# EAGLE design PiHat-Extended (EAGLE 9.4.2)

## Sheet 1 of 4
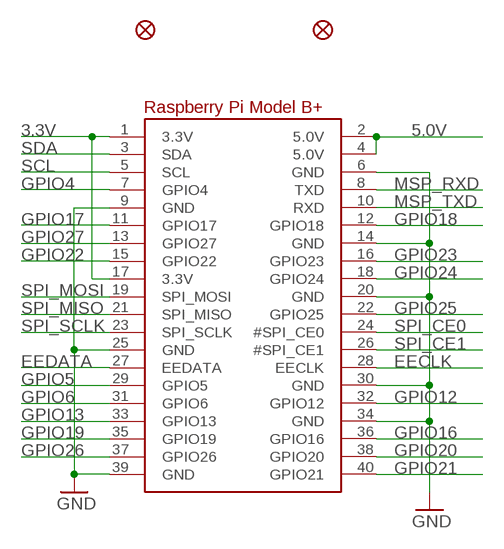
[diagram p0: schematic, sheet 1]

### Parts
FID2  MICROBUILDER_FIDUCIAL""  [MICROBUILDER_FIDUCIAL_1MM]
FID3  MICROBUILDER_FIDUCIAL""  [MICROBUILDER_FIDUCIAL_1MM]
RPI1  MICROBUILDER_RASPBERRYPI_BPLUS_HATNOSLOTS  [MICROBUILDER_PI_HAT_NOSLOTS]

### Nets
3.3V: RPI1.1(3.3V) RPI1.17(3.3V)
5.0V: RPI1.2(5.0V) RPI1.4(5.0V) ; also sheet 2,3
EECLK: RPI1.28(EECLK)
EEDATA: RPI1.27(EEDATA)
GND: RPI1.6(GND) RPI1.9(GND) RPI1.14(GND) RPI1.20(GND) RPI1.25(GND) RPI1.30(GND) RPI1.34(GND) RPI1.39(GND) ; also sheet 2,3,4
GPIO4: RPI1.7(GPIO4)
GPIO5: RPI1.29(GPIO5) ; also sheet 2
GPIO6: RPI1.31(GPIO6) ; also sheet 2
GPIO12: RPI1.32(GPIO12)
GPIO13: RPI1.33(GPIO13)
GPIO16: RPI1.36(GPIO16) ; also sheet 2,4
GPIO17: RPI1.11(GPIO17) ; also sheet 2,4
GPIO18: RPI1.12(GPIO18)
GPIO19: RPI1.35(GPIO19)
GPIO20: RPI1.38(GPIO20)
GPIO21: RPI1.40(GPIO21)
GPIO22: RPI1.15(GPIO22) ; also sheet 2,4
GPIO23: RPI1.16(GPIO23) ; also sheet 2,4
GPIO24: RPI1.18(GPIO24) ; also sheet 2,4
GPIO25: RPI1.22(GPIO25) ; also sheet 2,4
GPIO26: RPI1.37(GPIO26) ; also sheet 2,4
GPIO27: RPI1.13(GPIO27) ; also sheet 2,4
MSP_RXD: RPI1.8(TXD) ; also sheet 2,3
MSP_TXD: RPI1.10(RXD) ; also sheet 2,3
SCL: RPI1.5(SCL)
SDA: RPI1.3(SDA)
SPI_CE0: RPI1.24(#SPI_CE0)
SPI_CE1: RPI1.26(#SPI_CE1)
SPI_MISO: RPI1.21(SPI_MISO)
SPI_MOSI: RPI1.19(SPI_MOSI)
SPI_SCLK: RPI1.23(SPI_SCLK)

## Sheet 2 of 4
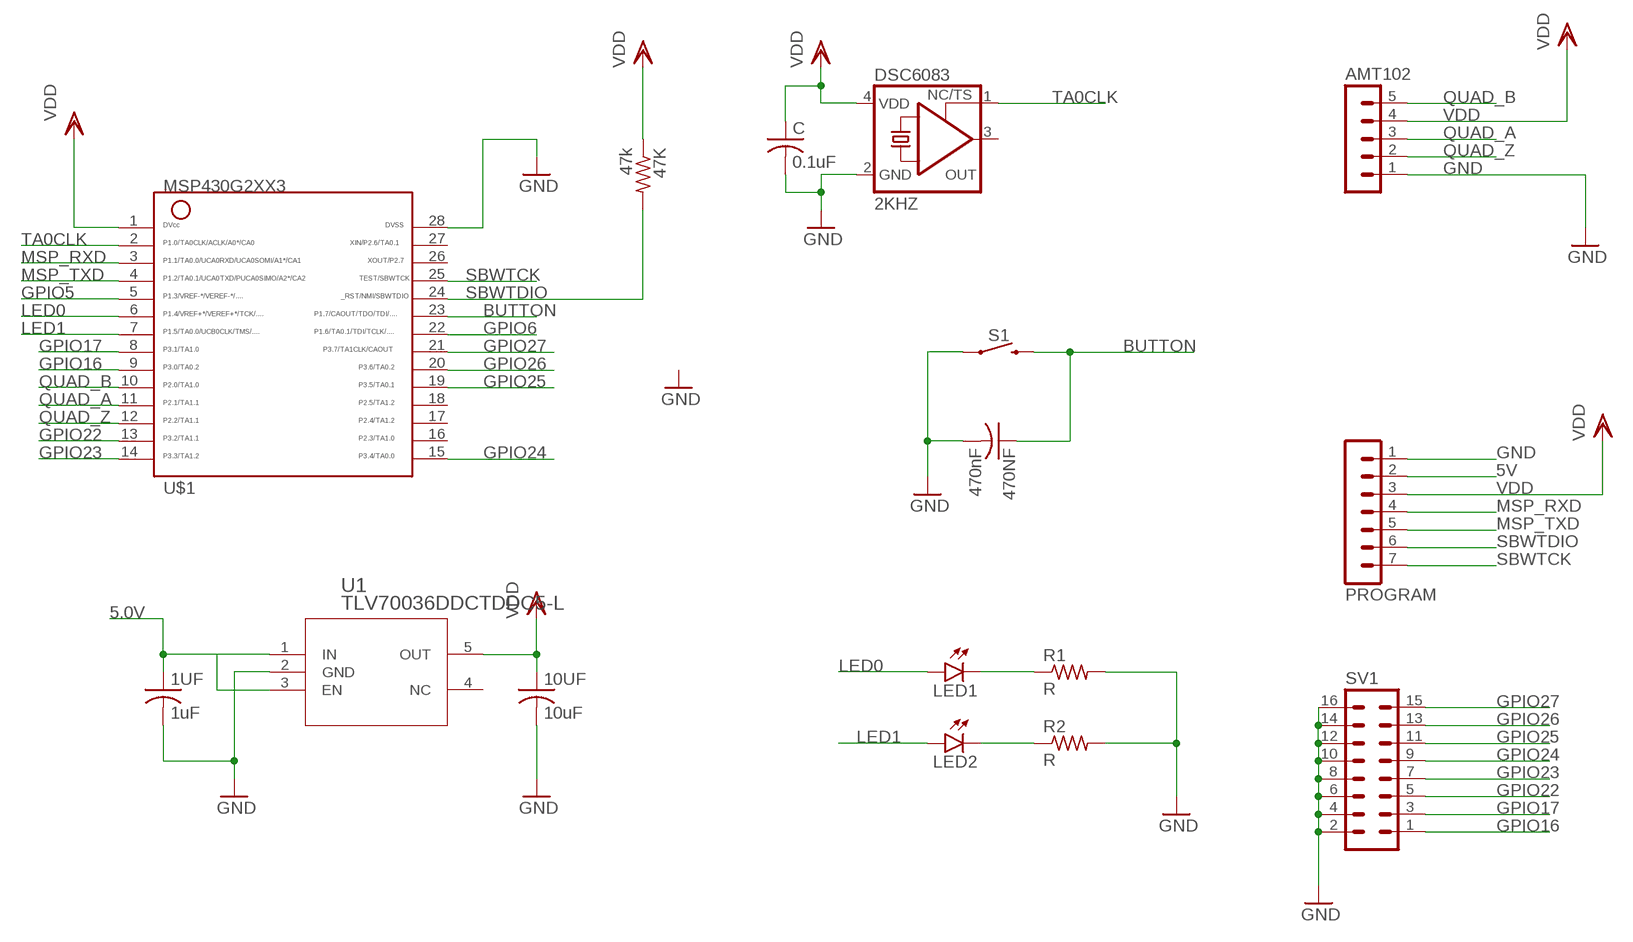
[diagram p1: schematic, sheet 2]

### Parts
1UF  1uF  C-USC0603  [C0603]
10UF  10uF  C-USC1206  [C1206]
47K  47k  R-US_R0603  [R0603]
470NF  470nF  C-USC0603  [C0603]
AMT102  MA05-1  [MA05-1]
C  0.1uF  C-USC0603  [C0603]
DSC6083  2KHZ  KXO-PXO/XO-V96  [3.2X2.5_KXO-V96]
LED1  LEDCHIPLED_1206  [CHIPLED_1206]
LED2  LEDCHIPLED_1206  [CHIPLED_1206]
PROGRAM  MA07-1  [MA07-1]
R1  R  R-US_R0603  [R0603]
R2  R  R-US_R0603  [R0603]
S1  MOMENTARY-SWITCH-SPST-PTH-6.0MM  [TACTILE_SWITCH_PTH_6.0MM]
SV1  MA08-2  [MA08-2]
U1  TLV70036DDCTDDC5-L  [DDC5-L]
U$1  MSP430  G2XX3---PW28  [PW28]

### Nets
5.0V: 1UF.1 U1.1(IN) U1.3(EN) ; also sheet 1,3
5V: PROGRAM.2
BUTTON: 470NF.1 S1.3 U$1.23
GND: 1UF.2 10UF.2 470NF.2 AMT102.1 C.2 DSC6083.2(GND) PROGRAM.1 R1.2 R2.2 S1.1 SV1.2 SV1.4 SV1.6 SV1.8 SV1.10 SV1.12 SV1.14 SV1.16 U1.2(GND) U$1.28 ; also sheet 1,3,4
GPIO5: U$1.5 ; also sheet 1
GPIO6: U$1.22 ; also sheet 1
GPIO16: SV1.1 U$1.9 ; also sheet 1,4
GPIO17: SV1.3 U$1.8 ; also sheet 1,4
GPIO22: SV1.5 U$1.13 ; also sheet 1,4
GPIO23: SV1.7 U$1.14 ; also sheet 1,4
GPIO24: SV1.9 U$1.15 ; also sheet 1,4
GPIO25: SV1.11 U$1.19 ; also sheet 1,4
GPIO26: SV1.13 U$1.20 ; also sheet 1,4
GPIO27: SV1.15 U$1.21 ; also sheet 1,4
LED0: LED1.A U$1.6
LED1: LED2.A U$1.7
MSP_RXD: PROGRAM.4 U$1.3 ; also sheet 1,3
MSP_TXD: PROGRAM.5 U$1.4 ; also sheet 1,3
N$1: LED1.C R1.1
N$2: LED2.C R2.1
QUAD_A: AMT102.3 U$1.11
QUAD_B: AMT102.5 U$1.10
QUAD_Z: AMT102.2 U$1.12
SBWTCK: PROGRAM.7 U$1.25
SBWTDIO: 47K.2 PROGRAM.6 U$1.24
TA0CLK: DSC6083.1(TS) U$1.2
VDD: 10UF.1 47K.1 AMT102.4 C.1 DSC6083.4(VDD) PROGRAM.3 U1.5(OUT) U$1.1 ; also sheet 4
Unconnected: DSC6083.3(OUT) U1.4(NC) U$1.16 U$1.17 U$1.18 U$1.26 U$1.27

## Sheet 3 of 4
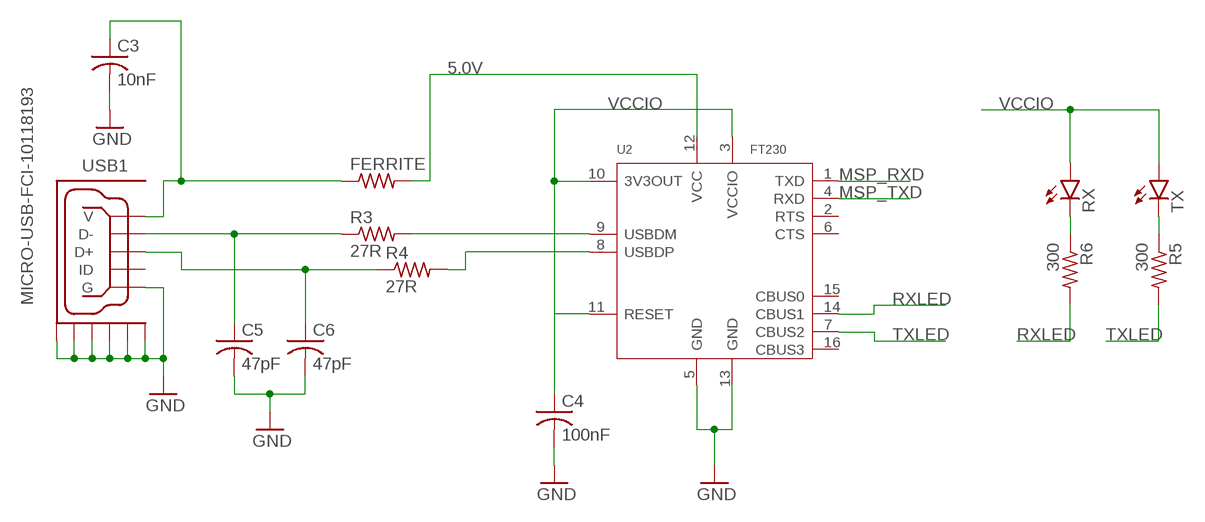
[diagram p2: schematic, sheet 3]

### Parts
C3  10nF  C-USC0603  [C0603]
C4  100nF  C-USC0603  [C0603]
C5  47pF  C-USC0603  [C0603]
C6  47pF  C-USC0603  [C0603]
FERRITE  R-US_R0805  [R0805]
R3  27R  R-US_R0603  [R0603]
R4  27R  R-US_R0603  [R0603]
R5  300  R-US_R0603  [R0603]
R6  300  R-US_R0603  [R0603]
RX  LEDCHIPLED_1206  [CHIPLED_1206]
TX  LEDCHIPLED_1206  [CHIPLED_1206]
U2  FT230  INTERFACE-FT230XS-R(SSOP16)  [SSOP16-0.635-5X4MM]
USB1  MICRO-USB-FCI-10118193  [FCI-10118193-0001LF]

### Nets
5.0V: FERRITE.2 U2.12(VCC) ; also sheet 1,2
GND: C3.2 C4.2 C5.2 C6.2 U2.5(GND) U2.13(GND) USB1.5(G) USB1.G1(GND1) USB1.G2(GND2) USB1.G3(GND3) USB1.G4(GND4) USB1.G5(GND5) USB1.G6(GND6) ; also sheet 1,2,4
MSP_RXD: U2.1(TXD) ; also sheet 1,2
MSP_TXD: U2.4(RXD) ; also sheet 1,2
N$3: C3.1 FERRITE.1 USB1.1(V)
N$4: C5.1 R3.1 USB1.2(D-)
N$5: R3.2 U2.9(USBDM)
N$7: C6.1 R4.1 USB1.3(D+)
N$8: R4.2 U2.8(USBDP)
N$9: R6.1 RX.C
N$10: R5.1 TX.C
RXLED: R6.2 U2.14(CBUS1)
TXLED: R5.2 U2.7(CBUS2)
VCCIO: C4.1 RX.A TX.A U2.3(VCCIO) U2.10(3V3OUT) U2.11(RESET)
Unconnected: U2.2(RTS) U2.6(CTS) U2.15(CBUS0) U2.16(CBUS3) USB1.4(ID)

## Sheet 4 of 4
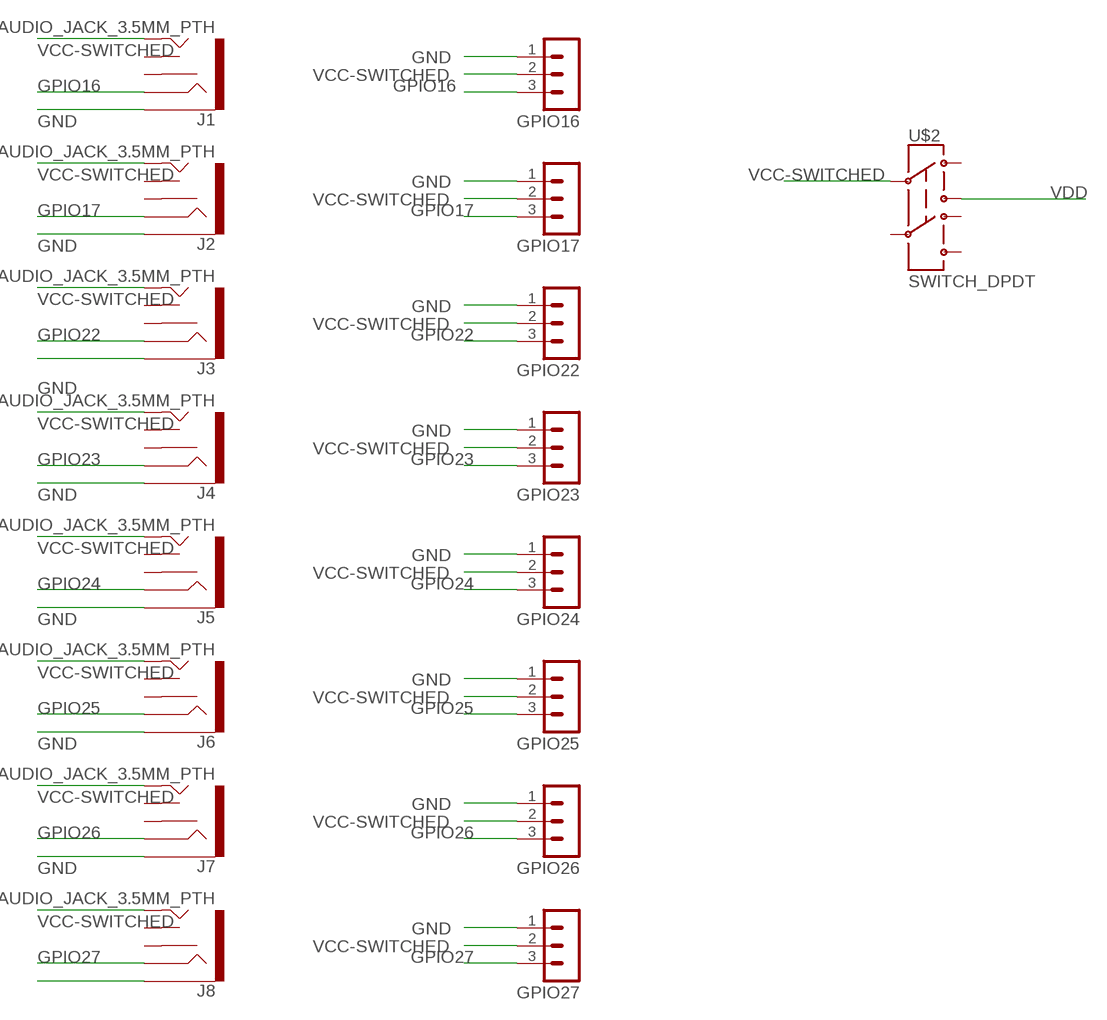
[diagram p3: schematic, sheet 4]

### Parts
GPIO16  MA03-1  [MA03-1]
GPIO17  MA03-1  [MA03-1]
GPIO22  MA03-1  [MA03-1]
GPIO23  MA03-1  [MA03-1]
GPIO24  MA03-1  [MA03-1]
GPIO25  MA03-1  [MA03-1]
GPIO26  MA03-1  [MA03-1]
GPIO27  MA03-1  [MA03-1]
J1  AUDIO_JACK_3.5MM_PTH  [AUDIO-JACK]
J2  AUDIO_JACK_3.5MM_PTH  [AUDIO-JACK]
J3  AUDIO_JACK_3.5MM_PTH  [AUDIO-JACK]
J4  AUDIO_JACK_3.5MM_PTH  [AUDIO-JACK]
J5  AUDIO_JACK_3.5MM_PTH  [AUDIO-JACK]
J6  AUDIO_JACK_3.5MM_PTH  [AUDIO-JACK]
J7  AUDIO_JACK_3.5MM_PTH  [AUDIO-JACK]
J8  AUDIO_JACK_3.5MM_PTH  [AUDIO-JACK]
U$2  SWITCH_DPDT  [JS_DPDT_TH]

### Nets
GND: GPIO16.1 GPIO17.1 GPIO22.1 GPIO23.1 GPIO24.1 GPIO25.1 GPIO26.1 GPIO27.1 J1.SLEEVE J2.SLEEVE J3.SLEEVE J4.SLEEVE J5.SLEEVE J6.SLEEVE J7.SLEEVE J8.SLEEVE ; also sheet 1,2,3
GPIO16: GPIO16.3 J1.RING ; also sheet 1,2
GPIO17: GPIO17.3 J2.RING ; also sheet 1,2
GPIO22: GPIO22.3 J3.RING ; also sheet 1,2
GPIO23: GPIO23.3 J4.RING ; also sheet 1,2
GPIO24: GPIO24.3 J5.RING ; also sheet 1,2
GPIO25: GPIO25.3 J6.RING ; also sheet 1,2
GPIO26: GPIO26.3 J7.RING ; also sheet 1,2
GPIO27: GPIO27.3 J8.RING ; also sheet 1,2
VCC-SWITCHED: GPIO16.2 GPIO17.2 GPIO22.2 GPIO23.2 GPIO24.2 GPIO25.2 GPIO26.2 GPIO27.2 J1.TIP J2.TIP J3.TIP J4.TIP J5.TIP J6.TIP J7.TIP J8.TIP U$2.2
VDD: U$2.3 ; also sheet 2
Unconnected: J1.RSH J1.TSH J2.RSH J2.TSH J3.RSH J3.TSH J4.RSH J4.TSH J5.RSH J5.TSH J6.RSH J6.TSH J7.RSH J7.TSH J8.RSH J8.TSH U$2.1 U$2.4 U$2.5 U$2.6

## Library data of the parts
1UF 10UF 470NF C = rcl:C-US: CAPACITOR, American symbol; SPICEPREFIX: C
47K FERRITE R1 R2 = rcl:R-US_: RESISTOR, American symbol; SPICEPREFIX: R
AMT102 = con-lstb-mod:MA05-1: PIN HEADER; OC_FARNELL: unknown; OC_NEWARK: unknown
C3-C6 = resistor:C-US: CAPACITOR, American symbol
DSC6083 = crystal-geyer_V1_0:KXO-PXO/XO-V: Clock Oscillator (PXO/XO) MHz : KXO-V - Serie Model Size l/w/h [mm] Frequency Range Frequency Stability Temp. Range [°C] Output AECQ 200 availabel Datasheet KXO-V94 KXO-V94 KXO-V95 KXO-V95 KXO-V96 KXO-V96 KXO-V99 KXO-V99 KXO-97 KXO-V97 KXO-97 - KXO-V97 2.0/1.6/0.80 2.0/1.6/0.80 2.5/2.0/0.82 2.5/2.0/0.82 3.2/2.5/1.2 3.2/2.5/1.2 5.0/3.2/1.2 5.0/3.2/1.2 7.0/5.08/1.3 7.0/5.08/1.3 7.0/5.08/1.3 32,768 kHz 1,0 ~ 80,0 MHz 32,768 kHz 1,0 ~ 70,0 MHz 32,768 kHz 1,0 ~ 156,0 MHz 32,768 kHz 1,0 ~ 200,0 MHz 32,768 kHz 32,768 kHz 1,0 ~ 160,0 MHz ±25 … ±100ppm ±25 … ±100ppm ±25 … ±100ppm ±25 … ±100ppm ±25 … ±100ppm ±25 … ±100ppm ±25 … ±100ppm ±25 … ±100ppm ±25 … ±100ppm ±25 … ±100ppm ±25 … ±100ppm (*) -40°C …+85°C (*) -40°C …+85°C (*) -40°C …+85°C (*) -40°C …+85°C (*) -40°C …+85°C (*) -40°C …+85°C (*) -40°C …+85°C (*) -40°C …+85°C (*) -40°C …+85°C (*) -40°C …+85°C (*) -40°C …+85°C HCMOS HCMOS HCMOS HCMOS HCMOS HCMOS HCMOS HCMOS HCMOS HCMOS HCMOS - - yes yes yes yes - - - - - KXO-V94-kHz.pdf <http://www.geyer-electronic.de/uploads/tx_userartikelfrequenz/GEYER-KXO-V94-kHz.pdf> KXO-V94.pdf <http://www.geyer-electronic.de/uploads/tx_userartikelfrequenz/GEYER-KXO-V94.pdf> KXO-V95-kHz.pdf <http://www.geyer-electronic.de/uploads/tx_userartikelfrequenz/GEYER-KXO-V95-kHz.pdf> KXO-V95.pdf <http://www.geyer-electronic.de/uploads/tx_userartikelfrequenz/GEYER-KXO-V95.pdf> KXO-V96-kHz.pdf <http://www.geyer-electronic.de/uploads/tx_userartikelfrequenz/GEYER-KXO-V96-kHz.pdf> KXO-V96.pdf <http://www.geyer-electronic.de/uploads/tx_userartikelfrequenz/GEYER-KXO-V96.pdf> KXO-V99-kHz.pdf <http://www.geyer-electronic.de/uploads/tx_userartikelfrequenz/GEYER-KXO-V99-kHz.pdf> KXO-V99.pdf <http://www.geyer-electronic.de/uploads/tx_userartikelfrequenz/GEYER-KXO-V99.pdf> KXO-97-kHz.pdf <http://www.geyer-electronic.de/uploads/tx_userartikelfrequenz/GEYER-KXO-97-kHz.pdf> KXO-V97-kHz.pdf <http://www.geyer-electronic.de/uploads/tx_userartikelfrequenz/GEYER-KXO-V97-kHz.pdf> KXO-V97.pdf <http://www.geyer-electronic.de/uploads/tx_userartikelfrequenz/GEYER-KXO-V97.pdf> <http://www.geyer-electronic.de/fileadmin/template/img/logo-geyer-electronic.png> Details see: http://www.geyer-electronic.de/Frequenz-Produkte.9.0.html Created 2016-06-07, Hans Locher 2016 (C) Geyer Quartz Technology Hans Locher KXOV94,KXOV95;KXOV96;KXOV97;KXO97;2016;2520;3225;5032;70508;2,5x2,0;3,2x2,5;5,0x3,2;7,0x5,08;2.5x2.0;3.2x2.5;5.0x3.2;7.0x5.08;
FID2 FID3 = PiHat-Extended:MICROBUILDER_FIDUCIAL: Fiducial Alignment Points Various fiducial points for machine vision alignment.; BOM: EXCLUDE
GPIO16 GPIO17 GPIO22-GPIO27 = con-lstb:MA03-1: PIN HEADER; OC_FARNELL: unknown; OC_NEWARK: unknown
J1-J8 = SparkFun-Connectors:AUDIO_JACK_3.5MM: Audio Jack 3.5mm variants of PTH and SMT stereo audio jack with bypass switches. SparkFun Products: SparkFun SparkPunk Sound Kit <[https://www.sparkfun.com/products/11177]> - PTH MP3 Trigger <https://www.sparkfun.com/products/13720> -3.5mm SMD SparkFun PicoBoard <https://www.sparkfun.com/products/11888>- 2.5mm SMD; PROD_ID: CONN-08774; SF_ID: PRT-08032
LED1 LED2 RX TX = led:LED: LED OSRAM: - CHIPLED LG R971, LG N971, LY N971, LG Q971, LY Q971, LO R971, LY R971 LH N974, LH R974 LS Q976, LO Q976, LY Q976 LO Q996 - Hyper CHIPLED LW Q18S LB Q993, LB Q99A, LB R99A - SideLED LS A670, LO A670, LY A670, LG A670, LP A670 LB A673, LV A673, LT A673, LW A673 LH A674 LY A675 LS A676, LA A676, LO A676, LY A676, LW A676 LS A679, LY A679, LG A679 - Hyper Micro SIDELED® LS Y876, LA Y876, LO Y876, LY Y876 LT Y87S - SmartLED LW L88C, LW L88S LB L89C, LB L89S, LG L890 LS L89K, LO L89K, LY L89K LS L896, LA L896, LO L896, LY L896 - TOPLED LS T670, LO T670, LY T670, LG T670, LP T670 LSG T670, LSP T670, LSY T670, LOP T670, LYG T670 LG T671, LOG T671, LSG T671 LB T673, LV T673, LT T673, LW T673 LH T674 LS T676, LA T676, LO T676, LY T676, LB T676, LH T676, LSB T676, LW T676 LB T67C, LV T67C, LT T67C, LS T67K, LO T67K, LY T67K, LW E67C LS E67B, LA E67B, LO E67B, LY E67B, LB E67C, LV E67C, LT E67C LW T67C LS T679, LY T679, LG T679 LS T770, LO T770, LY T770, LG T770, LP T770 LB T773, LV T773, LT T773, LW T773 LH T774 LS E675, LA E675, LY E675, LS T675 LS T776, LA T776, LO T776, LY T776, LB T776 LHGB T686 LT T68C, LB T68C - Hyper Mini TOPLED® LB M676 - Mini TOPLED Santana® LG M470 LS M47K, LO M47K, LY M47K Source: http://www.osram.convergy.de LUXEON: - LUMILED® LXK2-PW12-R00, LXK2-PW12-S00, LXK2-PW14-U00, LXK2-PW14-V00 LXK2-PM12-R00, LXK2-PM12-S00, LXK2-PM14-U00 LXK2-PE12-Q00, LXK2-PE12-R00, LXK2-PE12-S00, LXK2-PE14-T00, LXK2-PE14-U00 LXK2-PB12-K00, LXK2-PB12-L00, LXK2-PB12-M00, LXK2-PB14-N00, LXK2-PB14-P00, LXK2-PB14-Q00 LXK2-PR12-L00, LXK2-PR12-M00, LXK2-PR14-Q00, LXK2-PR14-R00 LXK2-PD12-Q00, LXK2-PD12-R00, LXK2-PD12-S00 LXK2-PH12-R00, LXK2-PH12-S00 LXK2-PL12-P00, LXK2-PL12-Q00, LXK2-PL12-R00 Source: www.luxeon.com KINGBRIGHT: KA-3528ASYC Source: www.kingbright.com
PROGRAM = con-lstb-mod:MA07-1: PIN HEADER; OC_FARNELL: unknown; OC_NEWARK: unknown
R3-R6 = resistor:R-US_: RESISTOR, American symbol
RPI1 = PiHat-Extended:MICROBUILDER_RASPBERRYPI_BPLUS
S1 = SparkFun-Switches:MOMENTARY-SWITCH-SPST: Momentary Switch (Pushbutton) - SPST Normally-open (NO) SPST momentary switches (buttons, pushbuttons). Variants PTH-12MM - 12mm square, through-hole Momentary Pushbutton Switch - 12mm Square <https://www.sparkfun.com/products/9190> (COM-09190) PTH-6.0MM, PTH-6.0MM-KIT - 6.0mm square, through-hole Mini Pushbutton Switch <https://www.sparkfun.com/products/97> (COM-00097) KIT package intended for soldering kit's - only one side of pads' copper is exposed. PTH-RIGHT-ANGLE-KIT - Right-angle, through-hole Right Angle Tactile Button <https://www.sparkfun.com/products/10791> - Used on SparkFun BigTime Watch Kit <https://www.sparkfun.com/products/11734> SMD-12MM - 12mm square, surface-mount Tactile Button - SMD (12mm) <https://www.sparkfun.com/products/12993> (COM-12993) Used on SparkFun PicoBoard <https://www.sparkfun.com/products/11888> SMD-4.5MM - 4.5mm Square Trackball Switch Used on SparkFun Blackberry Trackballer Breakout <https://www.sparkfun.com/products/13169> SMD-4.6MMX2.8MM - 4.60mm x 2.80mm, surface mount Used on SparkFun SAMD21 Mini Breakout <https://www.sparkfun.com/products/13664> SMD-5.2MM, SMD-5.2-REDUNDANT - 5.2mm square, surface-mount Mini Pushbutton Switch - SMD <https://www.sparkfun.com/products/8720> (COM-08720) Used on Arduino Pro Mini <https://www.sparkfun.com/products/11114> REDUNDANT package connects both switch circuits together SMD-6.0X3.5MM - 6.0 x 3.5mm, surface mount Momentary Reset Switch SMD <https://www.sparkfun.com/products/8229> (COM-08229) SMD-6.2MM-TALL - 6.2mm square, surface mount Tactile Button - SMD (6mm) <https://www.sparkfun.com/products/12992> Used on SparkFun Digital Sandbox <https://www.sparkfun.com/products/12651> SMD-RIGHT-ANGLE - Right-angle, surface mount Used on SparkFun Block for Intel® Edison - Arduino <https://www.sparkfun.com/products/13036>; PROD_ID: SWCH-08441; SF_SKU: COM-00097
SV1 = con-lstb-mod:MA08-2: PIN HEADER; OC_FARNELL: unknown; OC_NEWARK: unknown
U1 = TLV70036:TLV70036DDCT; MANUFACTURER_PART_NUMBER: TLV70036DDCT; VENDOR: Texas Instruments
U2 = OPL_IC:INTERFACE-FT230XS-R(SSOP16): 310070030; MPN: FT230XS-R; VALUE: FT230XS-R-SSOP16
U$1 = TI_MSP430_v16:G2XX3---PW28: MSP430G2XX1 TSSOP (PW) 28 Pin Package
U$2 = ELEC327:SWITCH_DPDT
USB1 = microftx:MICRO-USB: MICRO USB B, BOTTOM MOUNT From the MicroFTX by Jim Paris (http://jim.sh/ftx)

## Net classes
0 default: clearance 0.205 mm

## Board
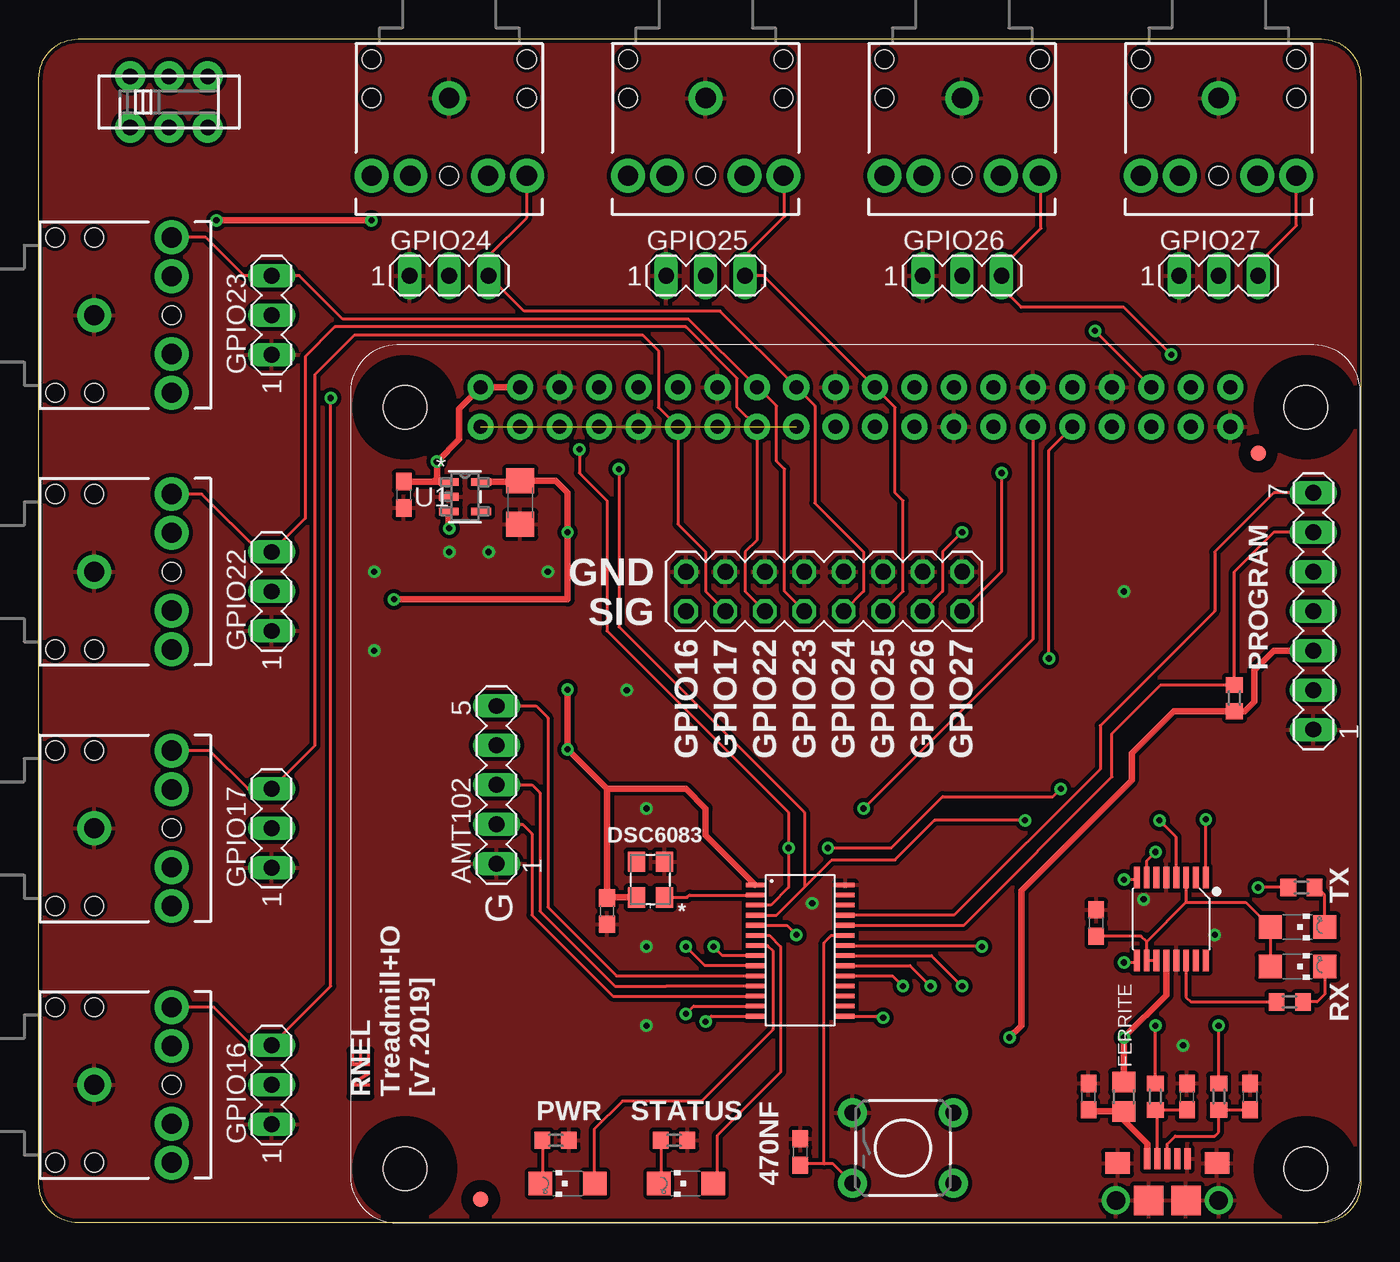
[diagram p4: board, top side]
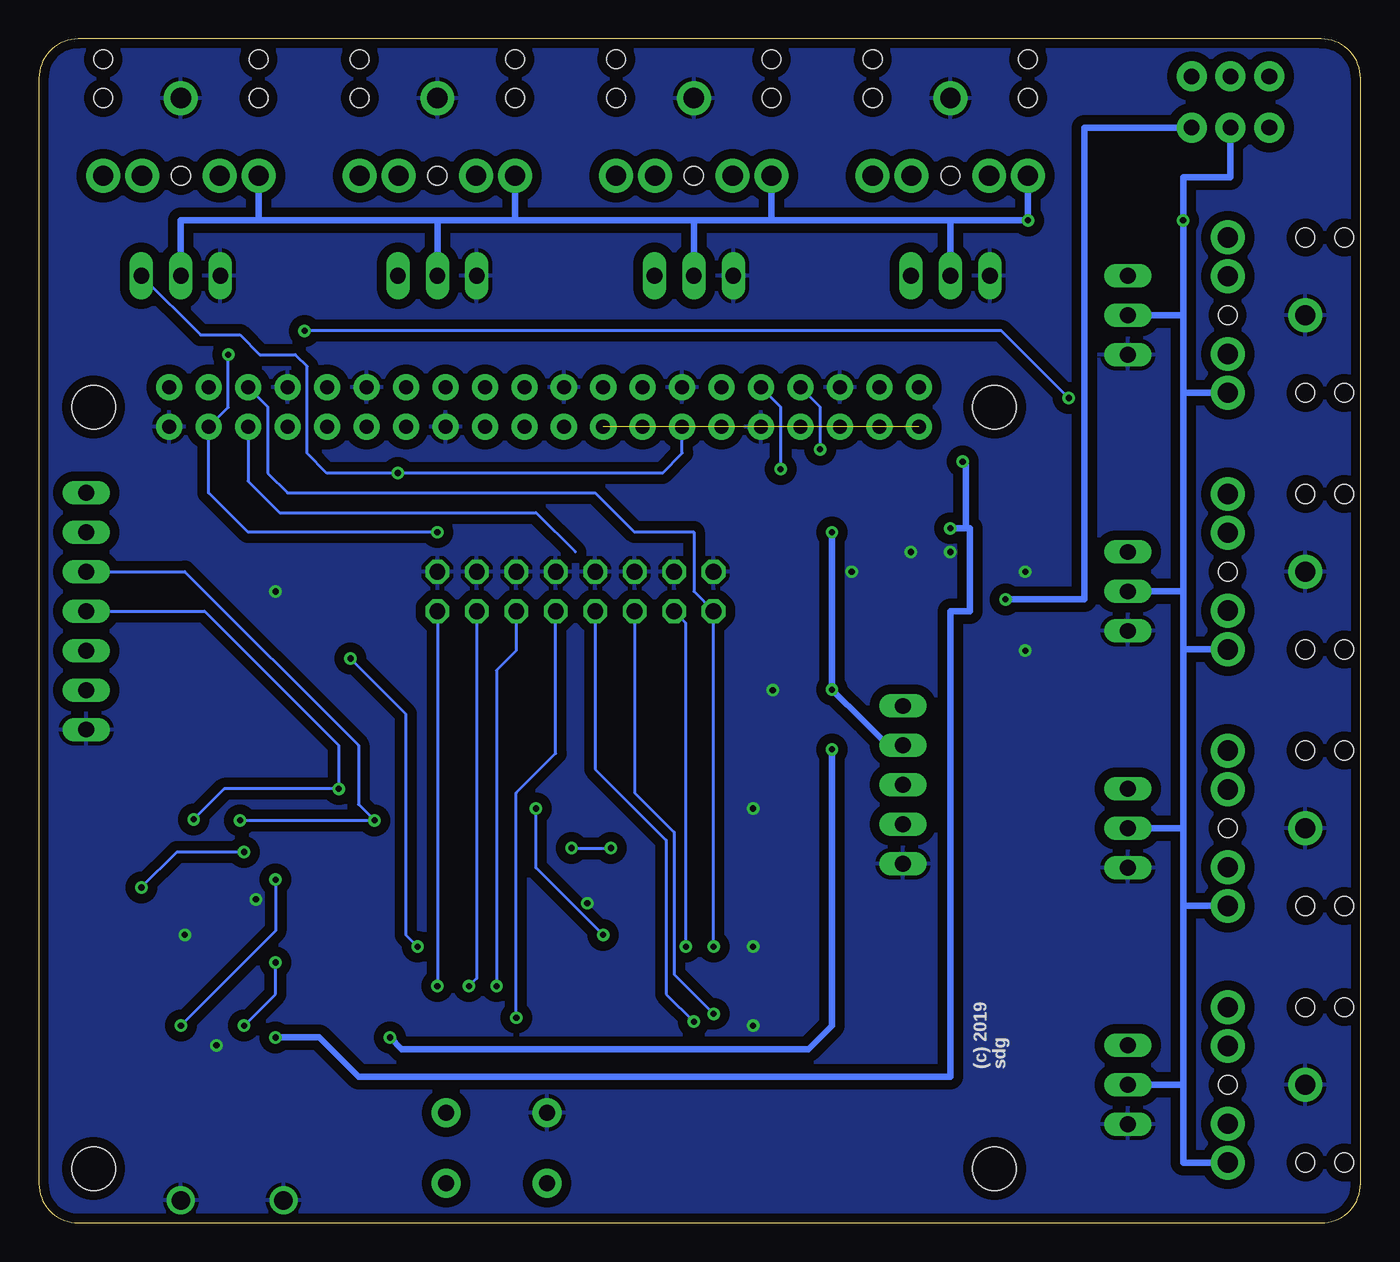
[diagram p5: board, bottom side, seen from below]

Size 85.09 x 76.2 mm. Coordinates in mm from the lower left corner, seen from the top.
Outline: 82.55,0 2.54,0 arc-90 0,2.54 0,73.66 arc-90 2.54,76.2 82.55,76.2 arc-90 85.09,73.66 85.09,2.54 arc-90 82.55,0
Copper layers (1*16): Top 0.035mm / dielectric 1.5mm / Bottom 0.035mm
Design rules "adafruit *": minimum track width 8mil, minimum drill 15.5mil, track to track 8mil, track to pad 8mil, pad to pad 8mil, via to via 8mil, smd to smd 8mil, copper to edge 10mil, drill to drill 8mil, minimum pad ring 10mil, minimum via ring 8mil, stop-mask expansion 2mil, vias tented up to drill 20mil, thermal gap 10mil

### Footprints (pad centres in the part's own frame; a part is rotated, then mirrored left to right if it is on the bottom)
C0603 = smd 1.1 x 1: 1 -0.85,0; 2 0.85,0
C1206 = smd 1.6 x 1.8: 1 -1.4,0; 2 1.4,0
R0603 = smd 1 x 1.1: 1 -0.85,0; 2 0.85,0
MA05-1 = drill 1.016 long: 1 -5.08,0; 2 -2.54,0; 3 0,0; 4 2.54,0; 5 5.08,0
3.2X2.5_KXO-V96 = smd 1.3 x 1.1: 1 -1.15,-0.9; 2 1.15,-0.9; 3 1.15,0.9; 4 -1.15,0.9
R0805 = smd 1.3 x 1.5: 1 -0.95,0; 2 0.95,0
MICROBUILDER_FIDUCIAL_1MM = smd 1 x 1: 1 0,0
MA03-1 = drill 1.016 long: 1 -2.54,0; 2 0,0; 3 2.54,0
AUDIO-JACK = drill 1.3 pad 2.184: RING 5,5; RSH 5,2.5; SLEEVE 0,0; TIP 5,-5; TSH 5,-2.5 | hole 1.2: 0,5; -2.5,5; -2.5,-5; 0,-5; 5,0
CHIPLED_1206 = smd 1.5 x 1.5: A 0,-1.75; C 0,1.75
MA07-1 = drill 1.016 long: 1 -7.62,0; 2 -5.08,0; 3 -2.54,0; 4 0,0; 5 2.54,0; 6 5.08,0; 7 7.62,0
MICROBUILDER_PI_HAT_NOSLOTS = drill 0.9 pad 1.676: 1 8.37,51.23; 2 8.37,53.77; 3 10.91,51.23; 4 10.91,53.77; 5 13.45,51.23; 6 13.45,53.77; 7 15.99,51.23; 8 15.99,53.77; 9 18.53,51.23; 10 18.53,53.77; 11 21.07,51.23; 12 21.07,53.77; 13 23.61,51.23; 14 23.61,53.77; 15 26.15,51.23; 16 26.15,53.77; 17 28.69,51.23; 18 28.69,53.77; 19 31.23,51.23; 20 31.23,53.77; 21 33.77,51.23; 22 33.77,53.77; 23 36.31,51.23; 24 36.31,53.77; 25 38.85,51.23; 26 38.85,53.77; 27 41.39,51.23; 28 41.39,53.77; 29 43.93,51.23; 30 43.93,53.77; 31 46.47,51.23; 32 46.47,53.77; 33 49.01,51.23; 34 49.01,53.77; 35 51.55,51.23; 36 51.55,53.77; 37 54.09,51.23; 38 54.09,53.77; 39 56.63,51.23; 40 56.63,53.77 | hole 2.8: 3.5,3.5; 3.5,52.5; 61.5,52.5; 61.5,3.5
TACTILE_SWITCH_PTH_6.0MM = drill 1.016 pad 1.88: 1 -3.251,2.261; 2 3.251,2.261; 3 -3.251,-2.261; 4 3.251,-2.261
MA08-2 = drill 1.016 octagon: 1 -8.89,-1.27; 2 -8.89,1.27; 3 -6.35,-1.27; 4 -6.35,1.27; 5 -3.81,-1.27; 6 -3.81,1.27; 7 -1.27,-1.27; 8 -1.27,1.27; 9 1.27,-1.27; 10 1.27,1.27; 11 3.81,-1.27; 12 3.81,1.27; 13 6.35,-1.27; 14 6.35,1.27; 15 8.89,-1.27; 16 8.89,1.27
DDC5-L = smd 1.27 x 0.508: 1 -1.041,0.95; 2 -1.041,0; 3 -1.041,-0.95; 4 1.041,-0.95; 5 1.041,0.95
SSOP16-0.635-5X4MM = smd 0.381 x 1.397: 1 -2.223,-2.667; 2 -1.587,-2.667; 3 -0.953,-2.667; 4 -0.318,-2.667; 5 0.318,-2.667; 6 0.953,-2.667; 7 1.587,-2.667; 8 2.223,-2.667; 9 2.223,2.667; 10 1.587,2.667; 11 0.953,2.667; 12 0.318,2.667; 13 -0.318,2.667; 14 -0.953,2.667; 15 -1.587,2.667; 16 -2.223,2.667
PW28 = smd 0.3 x 1.2: 1 -4.229,-2.908; 2 -3.579,-2.908; 3 -2.929,-2.908; 4 -2.279,-2.908; 5 -1.629,-2.908; 6 -0.979,-2.908; 7 -0.329,-2.908; 8 0.321,-2.908; 9 0.971,-2.908; 10 1.621,-2.908; 11 2.271,-2.908; 12 2.921,-2.908; 13 3.571,-2.908; 14 4.221,-2.908; 15 4.221,2.892; 16 3.571,2.892; 17 2.921,2.892; 18 2.271,2.892; 19 1.621,2.892; 20 0.971,2.892; 21 0.321,2.892; 22 -0.329,2.892; 23 -0.979,2.892; 24 -1.629,2.892; 25 -2.279,2.892; 26 -2.929,2.892; 27 -3.579,2.892; 28 -4.229,2.892
JS_DPDT_TH = drill 1 pad 1.93: 1 -2.5,-1.65; 2 0,-1.65; 3 2.5,-1.65; 4 -2.5,1.65; 5 0,1.65; 6 2.5,1.65
FCI-10118193-0001LF = smd 0.4 x 1.35: 1 -1.3,4.125; 2 -0.65,4.125; 3 0,4.125; 4 0.65,4.125; 5 1.3,4.125 | smd 1.6 x 1.4: G1 -3.2,3.86; G2 3.2,3.86 | smd 1.9 x 1.9: G3 -1.2,1.45; G4 1.2,1.45 | drill 1.2 pad 1.6: G5 -3.3,1.45; G6 3.3,1.45

### Placement (x,y rotation side)
1UF  23.5,46.86 270 top
10UF  30.99,46.35 270 top
47K  76.96,33.78 90 top
470NF  49.02,4.57 90 top
AMT102  29.46,28.19 90 top
C  36.58,20.07 270 top
C3  67.56,8.13 90 top
C4  68.07,19.3 90 top
C5  73.91,8.13 90 top
C6  77.98,8.13 90 top
DSC6083  39.37,22.1 90 top
FERRITE  69.85,8.13 90 top
FID2  28.45,1.52 0 top
FID3  78.49,49.53 0 top
GPIO16  14.99,8.89 90 top
GPIO17  14.99,25.4 90 top
GPIO22  14.99,40.64 90 top
GPIO23  14.99,58.42 90 top
GPIO24  26.42,60.96 0 top
GPIO25  42.93,60.96 0 top
GPIO26  59.44,60.96 0 top
GPIO27  75.95,60.96 0 top
J1  3.56,8.89 0 top
J2  3.56,25.4 0 top
J3  3.56,41.91 0 top
J4  3.56,58.42 0 top
J5  26.42,72.39 270 top
J6  42.93,72.39 270 top
J7  59.44,72.39 270 top
J8  75.95,72.39 270 top
LED1  41.66,2.54 90 top
LED2  34.04,2.54 90 top
PROGRAM  82.04,39.37 90 top
R1  40.89,5.33 0 top
R2  33.27,5.33 0 top
R3  71.88,8.13 90 top
R4  75.95,8.13 90 top
R5  81.28,21.59 180 top
R6  80.52,14.22 180 top
RPI1  20.07,0 0 top
RX  81.03,16.51 270 top
S1  55.63,4.83 0 top
SV1  50.55,40.64 0 top
TX  81.03,19.05 270 top
U1  27.43,46.74 0 top
U2  72.9,19.56 180 top
U$1  49.02,17.53 270 top
U$2  8.38,72.14 0 top
USB1  72.64,0 0 top

### Tracks (layer width: path | path; a pad name or v marks a point on that pad's centre or on a via)
3.3V  (1 unrouted)
5.0V  (via drill 0.39)
  Top 0.406: RPI1.4 RPI1.2 27.05,52.38 27.05,50.42 v25.62,48.99 25.62,47.94 25.4,47.71 | 1UF.1 25.4,47.71 | 25.4,47.71 26.36,47.71 U1.1 | U1.3 26.39,44.73 v26.42,44.7 | U2.12 72.58,14.67 v69.85,11.94 FERRITE.2
  Bottom 0.406: 25.4,44.7 25.4,48.77 v25.62,48.99 | v26.42,44.7 25.4,44.7 | 25.4,44.7 25.15,44.7 25.15,39.37 26.42,39.37 26.42,9.4 64.52,9.4 67.06,11.94 v69.85,11.94
BUTTON
  Top 0.203: S1.3 51.13,3.81 50.55,3.81 | 470NF.1 49.11,3.81 50.55,3.81 | U$1.23 51.02,18.5 50.55,18.03 50.55,3.81
GND  (via drill 0.39)
  other vias: 32.77,41.91 37.85,34.29 26.42,43.18 28.96,43.18 39.12,26.67 49.78,20.57 39.12,17.78 39.12,12.7 71.12,20.83 75.69,18.54 21.59,41.91 21.59,36.83 73.66,11.43 69.85,40.64
  pour Top (isolate 0.254): 0,0 0,76.2 85.09,76.2 85.09,0
  pour Bottom (isolate 0.61): 0,76.2 85.09,76.2 85.09,0 0,0
GPIO5  (via drill 0.39)
  Top 0.203: U$1.5 48.16,19.16 v48.77,18.54 | RPI1.29 64,37.58 v53.09,26.67
  Bottom 0.203: v48.77,18.54 53.09,22.86 v53.09,26.67
GPIO6  (via drill 0.39)
  Top 0.203: RPI1.31 65.02,49.72 v65.02,36.32 | U$1.22 60.63,17.86 v60.71,17.78
  Bottom 0.203: v60.71,17.78 61.47,18.54 61.47,32.77 v65.02,36.32
GPIO16  (via drill 0.39)
  Top 0.203: U$1.9 42.88,16.55 v41.66,17.78 | v18.8,53.09 18.8,15.24 GPIO16.3 13.72,11.43 11.26,13.89 J1.RING | RPI1.36 v67.98,57.4
  Bottom 0.203: RPI1.36 70.36,52.51 70.36,48.26 69.09,46.99 49.28,46.99 46.74,44.45 42.93,44.45 42.93,40.64 SV1.1 v41.66,17.78 | v18.8,53.09 23.11,57.4 v67.98,57.4
GPIO17  (via drill 0.39)
  Top 0.203: SV1.3 42.93,40.64 42.93,43.18 41.14,44.97 RPI1.11 39.88,52.49 39.88,56.13 38.86,57.15 20.32,57.15 17.78,54.61 17.78,30.73 GPIO17.3 13.46,27.94 11,30.4 J2.RING | U$1.8 44.01,17.2 v43.43,17.78
  Bottom 0.203: v43.43,17.78 43.43,38.61 SV1.3
GPIO19
  Bottom 0.203: 50.55,43.18 53.09,45.72 69.6,45.72 71.62,47.74 RPI1.35
GPIO22  (via drill 0.39)
  Top 0.203: v41.66,13.46 42.15,13.96 U$1.13 | SV1.5 45.47,40.64 45.47,43.18 46.22,43.93 RPI1.15 44.96,52.49 44.96,54.36 41.66,57.66 19.05,57.66 17.14,55.75 17.14,45.34 GPIO22.3 14.22,43.18 10.49,46.91 J3.RING
  Bottom 0.203: SV1.5 46.74,27.69 44.2,25.15 44.2,16 v41.66,13.46
GPIO23  (via drill 0.39)
  Top 0.203: v42.93,12.95 43.28,13.3 U$1.14 | SV1.7 48.01,40.64 48.01,48.51 47.5,49.02 47.5,52.58 46.31,53.77 RPI1.16 41.82,58.17 19.56,58.17 16.76,60.96 GPIO23.3 13.21,60.96 10.75,63.42 J4.RING
  Bottom 0.203: SV1.7 49.28,29.21 44.7,24.64 44.7,14.73 v42.93,12.95
GPIO24  (via drill 0.39)
  Top 0.203: SV1.9 53.09,40.64 53.09,43.18 49.95,46.32 49.95,52.58 RPI1.18 43.85,58.67 31.24,58.67 GPIO24.3 28.96,62.23 31.42,64.69 J5.RING | U$1.15 54.26,13.3 v54.36,13.21
  Bottom 0.203: SV1.9 51.82,30.23 54.36,27.69 v54.36,13.21
GPIO25  (via drill 0.39)
  Top 0.203: SV1.11 55.63,40.64 55.63,46.48 55.12,46.99 55.12,52.49 RPI1.22 46.65,60.96 GPIO25.3 45.47,62.23 48.01,64.77 48.01,67.31 J6.RING | U$1.19 54.96,15.9 v55.63,15.24
  Bottom 0.203: SV1.11 54.36,36.83 55.63,35.56 v55.63,15.24
GPIO26  (via drill 0.39)
  Top 0.203: v59.44,44.45 58.17,43.18 58.17,40.64 SV1.13 | U$1.20 56.09,16.55 v57.4,15.24 | v72.9,55.88 69.85,58.93 63.25,58.93 61.98,60.2 GPIO26.3 61.98,61.47 64.52,64.01 64.52,67.31 J7.RING
  Bottom 0.203: v59.44,44.45 71.63,44.45 74.17,46.99 74.17,51.22 RPI1.37 72.9,52.49 v72.9,55.88 | SV1.13 56.9,15.75 v57.4,15.24
GPIO27  (via drill 0.39)
  Top 0.203: v61.98,48.26 61.98,41.91 SV1.15 | U$1.21 57.47,17.2 v59.44,15.24 | GPIO27.3 78.49,61.72 80.95,64.18 J8.RING
  Bottom 0.203: RPI1.13 43.68,49.54 44.96,48.26 v61.98,48.26 66.55,48.26 67.82,49.53 67.82,55.12 68.58,55.88 70.87,55.88 72.14,57.15 74.68,57.15 GPIO27.3 | SV1.15 v59.44,15.24
LED0
  Top 0.203: LED1.A 43.66,2.79 43.66,5.62 47.75,9.71 47.75,17.78 47.03,18.5 U$1.6
LED1
  Top 0.203: LED2.A 35.79,6.07 37.56,7.85 42.64,7.85 47.24,12.45 47.24,17.53 46.91,17.86 U$1.7
MSP_RXD  (via drill 0.39)
  Top 0.203: U$1.3 47.12,20.45 48.26,21.59 v48.26,24.13 48.26,26.42 36.58,38.1 36.58,46.48 34.8,48.26 v34.8,49.78 | v50.8,24.13 54.86,24.13 58.17,27.43 65.28,27.43 v65.79,27.94 | U2.1 v75.12,25.97
  Bottom 0.203: RPI1.8 34.8,52.51 v34.8,49.78 | PROGRAM.4 74.42,39.37 65.79,30.73 v65.79,27.94 73.15,27.94 v75.12,25.97 | v50.8,24.13 v48.26,24.13
MSP_TXD  (via drill 0.39)
  Top 0.203: U$1.4 47.49,19.8 49.28,21.59 | 49.28,21.59 51.05,23.37 55.12,23.37 57.66,25.91 v63.48,25.91 | v37.34,48.51 37.34,38.35 49.28,26.42 49.28,21.59 | U2.4 73.22,24.83 v72.14,25.91
  Bottom 0.203: RPI1.10 37.34,52.51 v37.34,48.51 | PROGRAM.5 75.69,41.91 64.52,30.73 64.52,26.94 v63.48,25.91 v72.14,25.91
N$1
  Top 0.203: R1.1 40.04,2.68 LED1.C
N$2
  Top 0.203: R2.1 32.42,2.68 LED2.C
N$3
  Top 0.406: USB1.1 71.34,5.11 69.85,6.6 FERRITE.1 67.66,7.18 C3.1
N$4
  Top 0.203: USB1.2 71.99,7.17 R3.1 C5.1
N$5  (via drill 0.39)
  Top 0.203: v69.85,16.76 70.55,16.76 U2.9 | R3.2 v71.88,12.7
  Bottom 0.203: v71.88,12.7 69.85,14.73 v69.85,16.76
N$7
  Top 0.203: USB1.3 72.64,5.08 73.15,5.59 75.69,5.59 75.95,5.84 R4.1 C6.1
N$8  (via drill 0.39)
  Top 0.203: U2.8 70.55,22.1 v69.85,22.1 | R4.2 v75.95,12.7
  Bottom 0.203: v69.85,22.1 69.85,18.8 v75.95,12.7
N$9
  Top 0.203: RX.C 82.78,14.7 82.3,14.22 R6.1
N$10
  Top 0.203: R5.1 82.3,21.59 82.78,21.11 TX.C
QUAD_A
  Top 0.203: U$1.11 40.39,15.26 40.39,15.24 37.08,15.24 32.26,20.07 32.26,27.69 31.75,28.19 AMT102.3
QUAD_B
  Top 0.203: U$1.10 37.18,15.9 32.77,20.32 32.77,32.51 32,33.27 AMT102.5
QUAD_Z
  Top 0.203: AMT102.2 31.14,25.65 31.75,25.04 31.75,19.81 36.96,14.61 U$1.12
RXLED
  Top 0.203: U2.14 73.85,14.54 74.17,14.22 R6.2
SBWTCK
  Top 0.203: PROGRAM.7 79.5,46.99 75.69,43.18 75.69,39.37 68.33,32 68.33,29.21 58.92,19.8 U$1.25
SBWTDIO
  Top 0.203: PROGRAM.6 79.5,44.45 76.96,41.91 47K.2 72.22,34.63 69.09,31.5 69.09,28.7 59.54,19.16 U$1.24
TA0CLK
  Top 0.203: U$1.2 41.89,21.11 41.73,20.95 DSC6083.1
TXLED  (via drill 0.39)
  Top 0.203: U2.7 71.31,23.3 v71.88,23.88 | R5.2 v78.49,21.59
  Bottom 0.203: v78.49,21.59 76.2,23.88 v71.88,23.88
VCC-SWITCHED  (via drill 0.39)
  Top 0.406: v21.42,64.52 v11.43,64.52
  Bottom 0.406: GPIO23.2 11.43,58.42 | 11.43,53.42 11.43,58.42 | 11.43,53.42 J4.TIP | 11.43,53.42 11.43,40.64 | 11.43,40.64 GPIO22.2 | 11.43,40.64 11.43,36.91 | J3.TIP 11.43,36.91 | 11.43,36.91 11.43,25.4 | 11.43,25.4 GPIO17.2 | 11.43,25.4 11.43,20.4 | 11.43,20.4 J2.TIP | 11.43,20.4 11.43,8.89 | 11.43,8.89 GPIO16.2 | 11.43,8.89 11.43,3.89 J1.TIP | J5.TIP v21.42,64.52 26.42,64.52 | GPIO24.2 26.42,64.52 | GPIO25.2 42.93,64.52 | 42.93,64.52 37.93,64.52 | 37.93,64.52 26.42,64.52 | GPIO26.2 59.44,64.52 | 59.44,64.52 54.44,64.52 | 54.44,64.52 42.93,64.52 | GPIO27.2 75.95,64.52 70.95,64.52 | 70.95,64.52 59.44,64.52 | J8.TIP 70.95,64.52 | J7.TIP 54.44,64.52 | J6.TIP 37.93,64.52 | 11.43,58.42 v11.43,64.52 11.43,67.31 8.38,67.31 U$2.2
VCCIO
  Top 0.203: U2.11 U2.10 71.31,18.1 | C4.1 70.95,18.45 71.31,18.1 | U2.3 73.85,20.64 | 73.85,20.64 71.31,18.1 | 73.85,20.64 77.69,20.64 TX.A RX.A
VDD  (via drill 0.39)
  Top 0.406: U1.5 30.92,47.69 10UF.1 33.27,47.76 34.04,46.99 v34.04,44.45 34.04,40.13 v22.86,40.13 | 36.58,27.94 v34.04,30.48 v34.04,34.33 | 36.58,27.94 C.1 36.61,20.95 DSC6083.4 | U$1.1 42.93,24.94 42.93,26.67 41.66,27.94 36.58,27.94 | v62.48,11.94 63.25,12.7 63.25,21.38 70.36,28.49 70.36,30.23 73.06,32.93 47K.1 77.64,32.93 78.23,33.53 78.23,35.56 79.5,36.83 PROGRAM.3
  Bottom 0.254: 31.99,32.28 31.86,32.15
  Bottom 0.406: 31.99,32.28 v34.04,34.33 v34.04,44.45 | v34.04,30.48 34.04,12.7 35.56,11.18 61.72,11.18 v62.48,11.94 | AMT102.4 30.44,30.73 31.86,32.15 | U$2.3 17.78,70.49 17.78,40.13 v22.86,40.13

### Text on the board
Top: NE
tPlace: GND | SIG | GPIO16 / GPIO17 / GPIO22 / GPIO23 / GPIO24 / GPIO25 / GPIO26 / GPIO27 | * | RNEL / Treadmill+IO / [v7.2019] | PWR | STATUS
bPlace: (c) 2019 / sdg
tNames: G
tStop: NE